# Altium schematic sheet Twostagedesign.SchDoc
size A; SheetNumber: 1; SheetTotal: 1
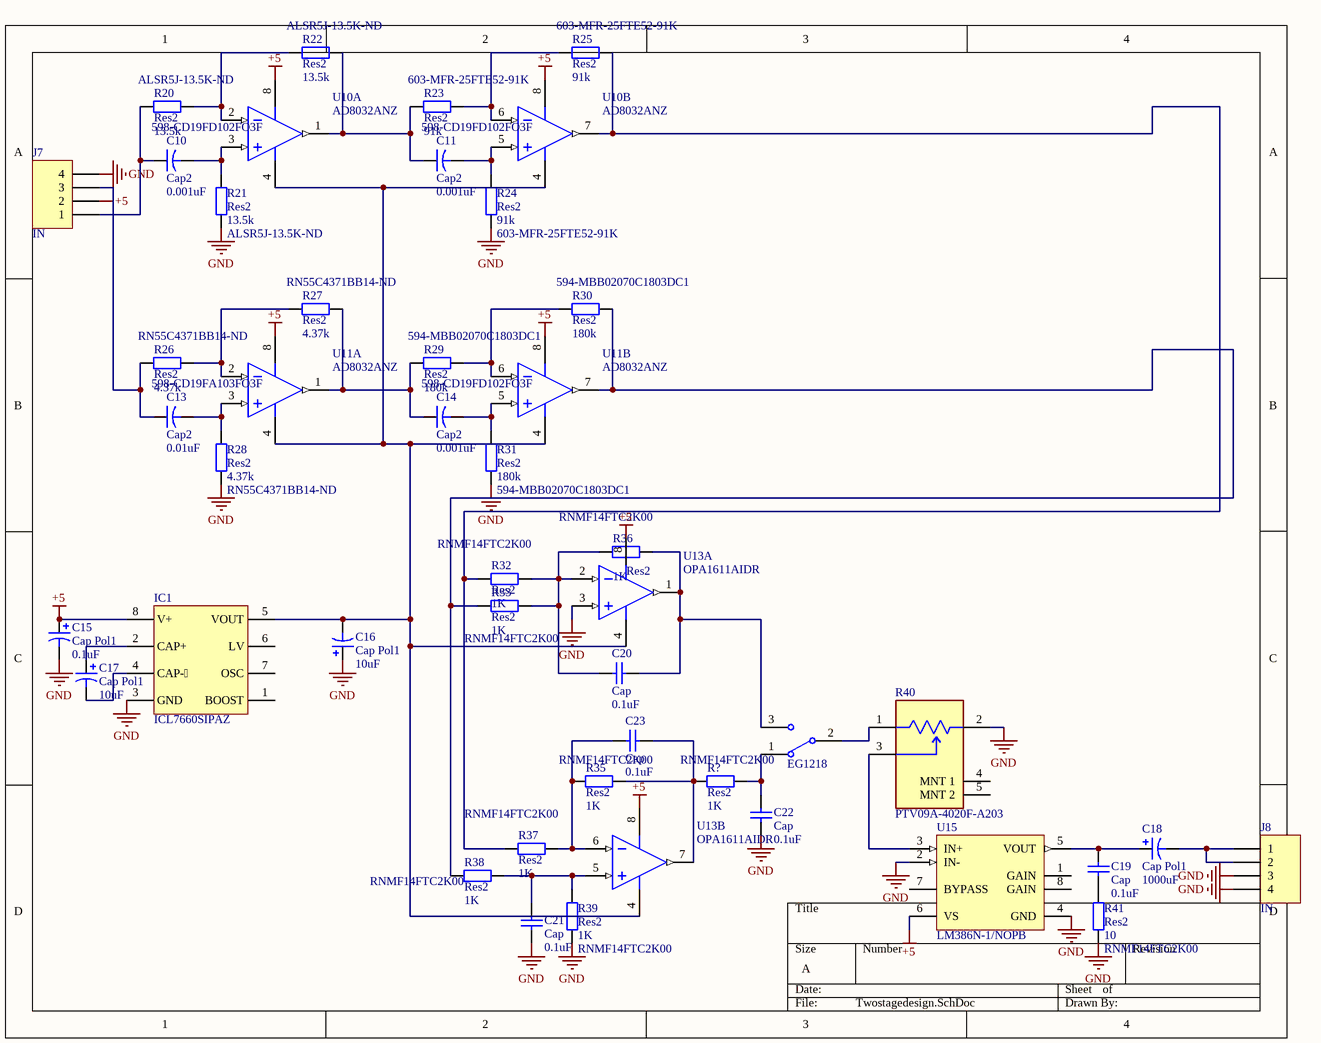
[diagram p0: Twostagedesign.SchDoc]

## Parts
?  EG1218  [ESWI-EG1218_V]
C10  Cap2  value 0.001uF  Supplier Part Number 1: 598-CD19FD102FO3F  [CAPR5-4X5]
C11  Cap2  value 0.001uF  Supplier Part Number 1: 598-CD19FD102FO3F  [CAPR5-4X5]
C13  Cap2  value 0.01uF  Supplier Part Number 1: 598-CD19FA103FO3F  [CAPR5-4X5]
C14  Cap2  value 0.001uF  Supplier Part Number 1: 598-CD19FD102FO3F  [CAPR5-4X5]
C15  Cap Pol1  value 0.1uF  [CAPR5-4X5]
C16  Cap Pol1  value 10uF  [CAPR5-4X5]
C17  Cap Pol1  value 10uF  [CAPR5-4X5]
C18  Cap Pol1  value 1000uF  [CAPR5-4X5]
C19  Cap  value 0.1uF  [CAPR5-4X5]
C20  Cap  value 0.1uF  [CAPR5-4X5]
C21  Cap  value 0.1uF  [CAPR5-4X5]
C22  Cap  value 0.1uF  [CAPR5-4X5]
C23  Cap  value 0.1uF  [CAPR5-4X5]
IC1  ICL7660SIPAZ  [DIP762W45P254L960H533Q8B]
J7  IN  [61300411121]
J8  IN  [61300411121]
R20  Res2  value 13.5k  Supplier Part Number 1: ALSR5J-13.5K-ND  [AXIAL-0.4]
R21  Res2  value 13.5k  Supplier Part Number 1: ALSR5J-13.5K-ND  [AXIAL-0.4]
R22  Res2  value 13.5k  Supplier Part Number 1: ALSR5J-13.5K-ND  [AXIAL-0.4]
R23  Res2  value 91k  Supplier Part Number 1: 603-MFR-25FTE52-91K  [AXIAL-0.4]
R24  Res2  value 91k  Supplier Part Number 1: 603-MFR-25FTE52-91K  [AXIAL-0.4]
R25  Res2  value 91k  Supplier Part Number 1: 603-MFR-25FTE52-91K  [AXIAL-0.4]
R26  Res2  value 4.37k  Supplier Part Number 1: RN55C4371BB14-ND  [AXIAL-0.4]
R27  Res2  value 4.37k  Supplier Part Number 1: RN55C4371BB14-ND  [AXIAL-0.4]
R28  Res2  value 4.37k  Supplier Part Number 1: RN55C4371BB14-ND  [AXIAL-0.4]
R29  Res2  value 180k  Supplier Part Number 1: 594-MBB02070C1803DC1  [AXIAL-0.4]
R30  Res2  value 180k  Supplier Part Number 1: 594-MBB02070C1803DC1  [AXIAL-0.4]
R31  Res2  value 180k  Supplier Part Number 1: 594-MBB02070C1803DC1  [AXIAL-0.4]
R32  Res2  value 1K  Supplier Part Number 1: RNMF14FTC2K00  [AXIAL-0.4]
R33  Res2  value 1K  Supplier Part Number 1: RNMF14FTC2K00  [AXIAL-0.4]
R35  Res2  value 1K  Supplier Part Number 1: RNMF14FTC2K00  [AXIAL-0.4]
R36  Res2  value 1K  Supplier Part Number 1: RNMF14FTC2K00  [AXIAL-0.4]
R37  Res2  value 1K  Supplier Part Number 1: RNMF14FTC2K00  [AXIAL-0.4]
R38  Res2  value 1K  Supplier Part Number 1: RNMF14FTC2K00  [AXIAL-0.4]
R39  Res2  value 1K  Supplier Part Number 1: RNMF14FTC2K00  [AXIAL-0.4]
R40  PTV09A-4020F-A203  [FP-PTV09A-4020-MFG]
R41  Res2  value 10  Supplier Part Number 1: RNMF14FTC2K00  [AXIAL-0.4]
R?  Res2  value 1K  Supplier Part Number 1: RNMF14FTC2K00  [AXIAL-0.4]
U10  AD8032ANZ  [ADI-N-8]  (parts A,B of 2)
U11  AD8032ANZ  [ADI-N-8]  (parts A,B of 2)
U13  OPA1611AIDR  [D0008A_M]  (parts A,B of 2)
U15  LM386N-1/NOPB  [P0008A]

## Nets
+5: C15.1 IC1.8(V+) J7.2 U10.8(+VS) U11.8(+VS) U13.8(V+) U15.6(VS)
GND: C15.2 C16.2 C21.2 C22.2 IC1.3(GND) J7.4 J8.3 J8.4 R21.1 R24.1 R28.1 R31.1 R39.1 R40.2 R41.1 U13.3(IN_A+) U15.2(IN-) U15.4(GND)
Net?_1: ?.1 C22.1 R?.2
Net?_2: ?.2(COM) R40.1
Net?_3: ?.3 C20.1 R36.2 U13.1(OUT_A)
NetC10_1: C10.1 J7.1 R20.1
NetC10_2: C10.2 R21.2 U10.3(+IN_1)
NetC11_1: C11.1 R22.2 R23.1 U10.1(OUT_1)
NetC11_2: C11.2 R24.2 U10.5(+IN_2)
NetC13_1: C13.1 J7.3 R26.1
NetC13_2: C13.2 R28.2 U11.3(+IN_1)
NetC14_1: C14.1 R27.2 R29.1 U11.1(OUT_1)
NetC14_2: C14.2 R31.2 U11.5(+IN_2)
NetC16_1: C16.1 IC1.5(VOUT) U10.4(-VS) U11.4(-VS) U13.4(V-)
NetC17_1: C17.1 IC1.2(CAP+)
NetC17_2: C17.2 IC1.4(CAP-)
NetC18_1: C18.1 C19.2 U15.5(VOUT)
NetC18_2: C18.2 J8.1 J8.2
NetC19_1: C19.1 R41.2
NetC20_2: C20.2 R32.2 R33.2 R36.1 U13.2(IN_A-)
NetC21_1: C21.1 R38.2 R39.2 U13.5(IN_B+)
NetC23_1: C23.1 R35.2 R?.1 U13.7(OUT_B)
NetC23_2: C23.2 R35.1 R37.2 U13.6(IN_B-)
NetR20_2: R20.2 R22.1 U10.2(-IN_1)
NetR23_2: R23.2 R25.1 U10.6(-IN_2)
NetR25_2: R25.2 R32.1 R37.1 U10.7(OUT_2)
NetR26_2: R26.2 R27.1 U11.2(-IN_1)
NetR29_2: R29.2 R30.1 U11.6(-IN_2)
NetR30_2: R30.2 R33.1 R38.1 U11.7(OUT_2)
NetR40_3: R40.3 U15.3(IN+)

Not connected (* = marked no-connect by the designer): IC1 1(BOOST) 6(LV) 7(OSC); R40 4(MNT_1) 5(MNT_2); U15 1(GAIN) 7(BYPASS) 8(GAIN)

## Library data of the parts
? = CMP-1696-00002-1: Slide Switch, 500 V, -20 to 70 degC, 3-Pin THD, RoHS; Case\Package: SOT-23-5; Output Current: 150 mA; Nominal Output Voltage: 3.3 V; Max Power Dissipation: 250 mW; Min Input Voltage: 4.3 V; Outputs: 1; Max Input Voltage: 8 V; Dropout Voltage: 300 mV; PackageDescription: 3-Pin Through Hole Device, Body 11.6 x 4 mm, Pitch 2.5 mm; ComponentLink1URL: http://www.e-switch.ch/en/; RoHSCompliant: true; Length: 3 mm; ComponentLink1Description: Manufacturer URL; Power Rating: 250 mW; Mount: Surface Mount; Max Operating Temperature: 85 degC; REACH SVHC: No SVHC; Radiation Hardening: No; Height: 1.3 mm; Pins: 5; Max Ouput Current: 150 mA; Output Voltage: 3.3 V; Width: 1.8 mm; Package Quantity: 3000; ComponentLink2URL: https://www.e-switch.com/system/asset/product_line/data_sheet/119/EG.pdf; Min Operating Temperature: -40 degC; ComponentLink2Description: Datasheet; DatasheetVersion: Oct-15; PackageReference: EG1218; Packaging: Tape and Reel
C10 C11 C13 C14 = Cap2: Capacitor; Published: 23-Sep-2002; PackageReference: CAPR5-4X5; Publisher: Altium Limited; PackageDescription: Capacitor; 2 Leads; Supplier 1: Mouser
C15-C18 = Cap Pol1: Polarized Capacitor (Radial); Published: 8-Jun-2000; LatestRevisionDate: 17-Jul-2002; LatestRevisionNote: Re-released for DXP Platform.; PackageReference: RB7.6-15; Publisher: Altium Limited; PackageDescription: Polarized Capacitor (Radial); 2 Leads
C19-C23 = Cap: Capacitor; Published: 8-Jun-2000; LatestRevisionDate: 17-Jul-2002; LatestRevisionNote: Re-released for DXP Platform.; PackageReference: RAD-0.3; Publisher: Altium Limited; PackageDescription: Radial Cap, Thru-Hole; 2 Leads; 0.3 in Pin Spacing
IC1 = CMP-00572-88254228-1: ICL7660SIPAZ Charge Pump INV/STPUP/STPDN -1.5V to -12V/1.5V to 22.8V 45mA 8-Pin PDIP Tube; Output Type: Adjustable; Frequency: 10kHz; Packaging: Cut Tape; RoHS: Compliant; NexarPartId: 88254228; Output Current: 45mA; Output Voltage: -1.5V
J7 J8 = MHDR1X4: Header, 4-Pin; LatestRevisionDate: 17-Jul-2002; LatestRevisionNote: Re-released for DXP Platform.; Publisher: Altium Limited
R20-R33 R35-R39 R41 R? = Res2: Resistor; Published: 8-Jun-2000; LatestRevisionDate: 17-Jul-2002; LatestRevisionNote: Re-released for DXP Platform.; PackageReference: AXIAL-0.4; Publisher: Altium Limited; PackageDescription: Axial Device, Thru-Hole; 2 Leads; 0.4 in Pin Spacing
  R20-R22 R26-R28: Supplier 1: Digikey
  R23-R25 R29-R31: Supplier 1: Mouser
  R32 R33 R35-R39 R41 R?: Supplier 1: Arrow Electronics
R40 = CMP-07234-000017-1: POT 20K OHM 1/20W CARBON LOG; Manufacturer: Bourns Inc.; Tolerance: 20%; Voltage Rating: 50V; Description: 20k Ohm 1 Gang Logarithmic Through Hole, Snap In Potentiometer None 1 Kierros Carbon 0.05W, 1/20W PC Pins, Board Locks; Power Rating: 0.05W; Resistance: 20kΩ; Value: 20kΩ; Series: PTV09; Device Class L1: Passive Components; Mouser Description: Potentiometers 20K AUDIO 20%; Device Class L3: Variable Resistors and Potentiometers; Lead Free: Yes; Package: PTV09A-4020; ComponentLink2URL: https://www.bourns.com/docs/product-datasheets/ptv09.pdf?sfvrsn=5e1089f1_12; Octopart: https://octopart.com/ptv09a-4020f-a203-bourns-1637636; Temperature: -10°C to +50°C; Height: 20.5mm; ComponentLink2Description: Datasheet; Category: Res; Digikey Description: POT 20K OHM 1/20W CARBON LOG; Temperature Range High: +50°C; RoHS: TRUE; Device Class L2: Resistors; Composition: Carbon; Automotive: No; Manufacturer Part Number: PTV09A-4020F-A203; Temperature Range Low: -10°C
U10 U11 = CMP-0384-00245-2: Double Channel RRIO Operational Amplifier, 80 MHz BW, 35 V/us SR, Industrial, 8-pin DIP (N-8), Tube; Manufacturer: Analog Devices; Generic Part Number: AD8032; Input Offset Voltage: 1mV; V Span Max: 12V; Small Signal Bandwidth: 80MHz; Input Bias Current: 450nA; Amplifiers Per Package: 2; Slew Rate: 35V/us; V Span Min: 2.7V; Iq/Amp: 1.6mA; Mounting Technology: Through Hole; PackageDescription: 8-Pin Plastic Dual In-Line Package, Row spacing 7.62 mm, Pitch 2.54 mm; Code_JEDEC: MS-001; ComponentLink1URL: http://www.analog.com/en/index.html; ComponentLink4Description: Reference Circuit; ComponentLink2URL: http://www.analog.com/static/imported-files/data_sheets/AD8031_8032.pdf; ComponentLink1Description: Manufacturer URL; RevisionNote: Reference Circuit URL fixed; ComponentLink3Description: Package Specification; PackageVersion: 070606-A; DatasheetVersion: Rev. D; PartNumber: AD8032ANZ; ComponentLink4URL: http://www.analog.com/en/all-operational-amplifiers-op-amps/operational-amplifiers-op-amps/ad8032/products/product.html#product-recommendations; ComponentLink3URL: http:/www.analog.com/static/imported-files/packages/PKG_PDF/PDIP(N)/N_8.pdf; PackageReference: N-8; Packing: Tube; ComponentLink2Description: Datasheet
U13 = CMP-0808-00013-2: 1.1 nV/rtHz Noise, Low Power, Precision Operational Amplifier, 4.5 to 36 V, -40 to 85 degC, 8-pin SOIC (D8), Green (RoHS & no Sb/Br); Manufacturer: Texas Instruments; PartNumber: OPA1612AID; Number of Channels: 2; Vmin(V): 4.5; Vmax(V): 36; SubFamily: Audio Operational Amplifier; Vn at Flatband(Typ)(nV/rtHz): 1.1; GBW(Typ)(MHz): 40; ComponentLink3URL: http://www.ti.com/litv/pdf/msoi002j; ComponentLink3Description: Package Specification; PackageVersion: 4040047-3/M, 06/2011; Code_JEDEC: MS-012; Eco-Plan: Green (RoHS & no Sb/Br); PackageReference: D0008A; ComponentLink1Description: Manufacturer URL; ComponentLink2URL: http://www.ti.com/general/docs/lit/getliterature.tsp?genericPartNumber=OPA1612&fileType=pdf; DatasheetVersion: SBOS450B; ComponentLink1URL: http://www.ti.com/; PackageDescription: 8-Pin Plastic Small Outline, Body 4.9 x 3.9 mm, Pitch 1.27 mm; Iq per channel(Max)(mA): 4.5; Mounting Technology: Surface Mount; ComponentLink2Description: Datasheet
U15 = CMP-0057-00052-4: Low Voltage Audio Power Amplifier, 8-pin MDIP, Pb-Free; Manufacturer: Texas Instruments; PackageTopMarking: NSUZXYTTE#*LM*386N-1; PowerWise: N; CompType: Audio IC; RoHS: Y; PackageReference: P0008A; Code_JEDEC: MS-001-BA; PackageDescription: MDIP, .365 x .250 x .130in, 8 Lead, .100in Pitch; PinCount: 8; ComponentLink1URL: http://www.ti.com/general/docs/lit/getliterature.tsp?genericPartNumber=LM386&fileType=pdf; ComponentLink1Description: Datasheet URL